# Altium project StrainGaugeAmpli.PrjPcb
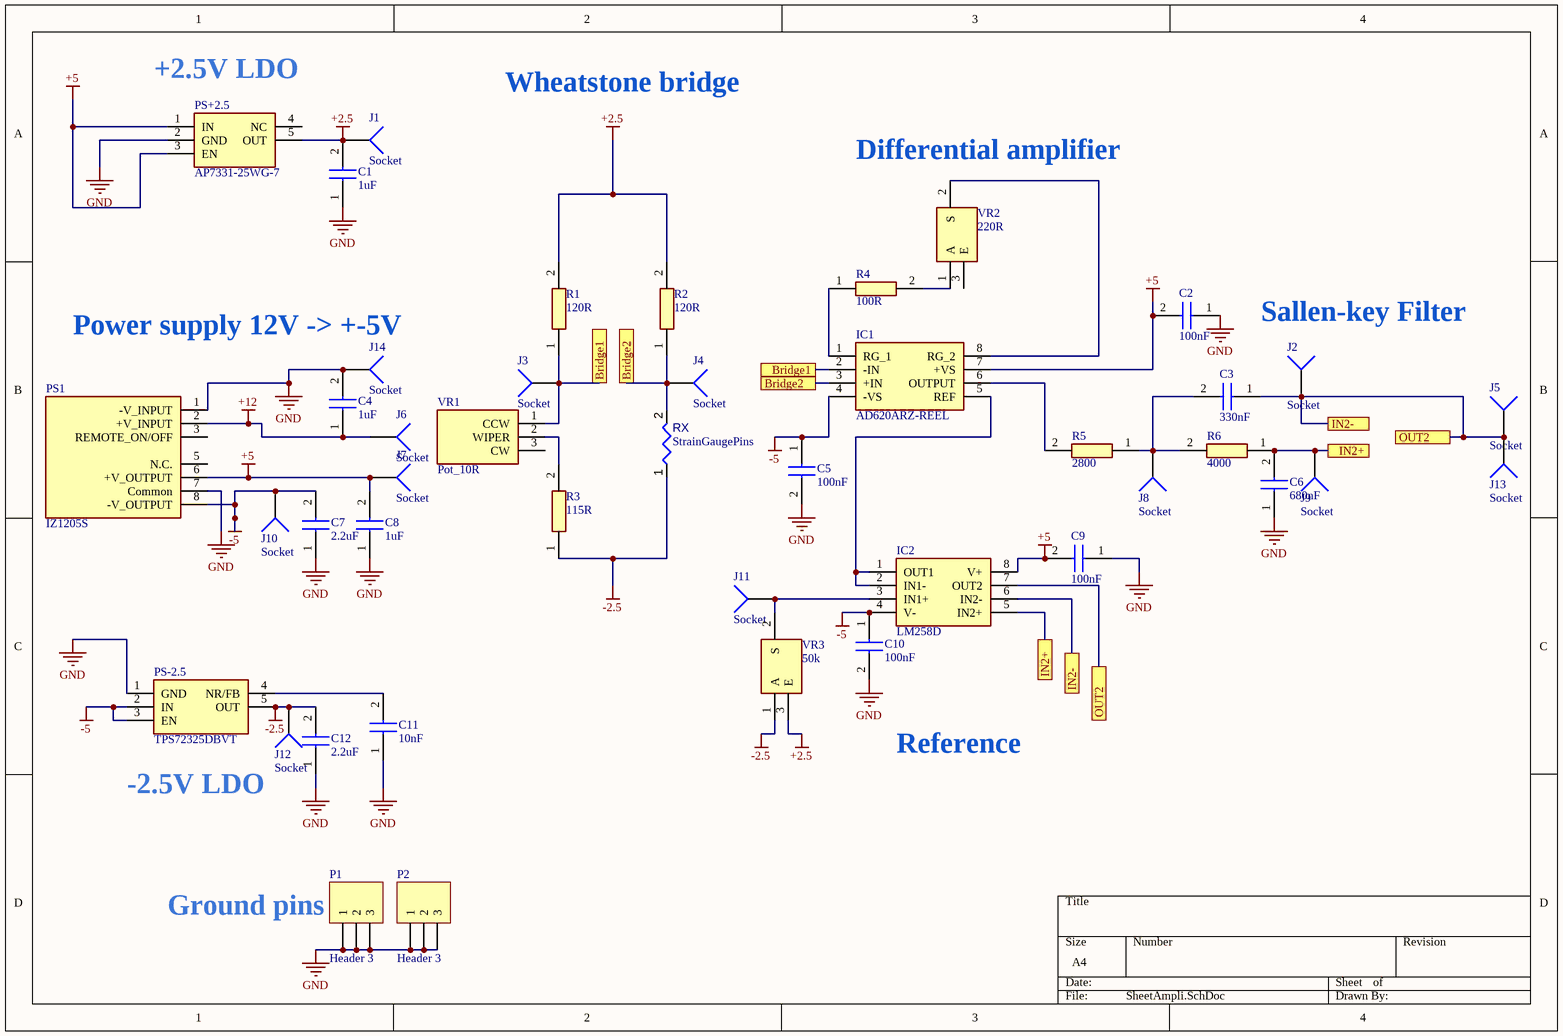
[diagram p0: SheetAmpli.SchDoc]
1 sheet, 43 parts. Net scope: flat (ports and power ports of the same name join across sheets).
Board file: PCBAmpli.PcbDoc

## Sheet SheetAmpli.SchDoc: Strain gauge amplification
size A4; Date: 27/05/2021; DrawnBy: M. Verstraeten; Revision: 1; SheetNumber: 1; SheetTotal: 1

### Parts
C1  1uF  [CAPC2012X94N]
C2  100nF  [CAPC2012X94N]
C3  330nF  [CAPC2012X94N]
C4  1uF  [CAPC2012X94N]
C5  100nF  [CAPC2012X94N]
C6  680nF  [CAPC2012X94N]
C7  2.2uF  [CAPC2012X94N]
C8  1uF  [CAPC2012X94N]
C9  100nF  [CAPC2012X94N]
C10  100nF  [CAPC2012X94N]
C11  10nF  [CAPC2012X94N]
C12  2.2uF  [CAPC2012X94N]
IC1  AD620ARZ-REEL  [SOIC127P600X175-8N]
IC2  LM258D  [SOIC127P600X175-8N]
J1  Socket  [PIN1]
J2  Socket  [PIN1]
J3  Socket  [PIN1]
J4  Socket  [PIN1]
J5  Socket  [PIN1]
J6  Socket  [PIN1]
J7  Socket  [PIN1]
J8  Socket  [PIN1]
J9  Socket  [PIN1]
J10  Socket  [PIN1]
J11  Socket  [PIN1]
J12  Socket  [PIN1]
J13  Socket  [PIN1]
J14  Socket  [PIN1]
P1  Header 3  [HDR1X3]
P2  Header 3  [HDR1X3]
PS1  IZ1205S  [IZ1205S]
PS+2.5  AP7331-25WG-7  [SOT95P285X130-5N]
PS-2.5  TPS72325DBVT  [SOT95P280X145-5N]
R1  120R  [RESC2012X65N]
R2  120R  [RESC2012X65N]
R3  115R  [RESC2012X65N]
R4  100R  [RESC2012X65N]
R5  2800  [RESC2012X65N]
R6  4000  [RESC2012X65N]
RX  value StrainGaugePins  [RESA60-630X240]
VR1  Pot_10R  [3296W-1]
VR2  220R  [PT10LV10473A2020PMS]
VR3  50k  [PT10LV10473A2020PMS]

### Ports
Bridge1, Bridge2, IN2+, IN2-, OUT2

### Nets
+2.5: C1.2 J1.1 PS+2.5.5(OUT) R1.2 R2.2 VR3.3(E)
+5: C2.2 C8.2 C9.2 IC1.7(+VS) IC2.8(V+) J7.1 PS1.6(+V_OUTPUT) PS+2.5.1(IN) PS+2.5.3(EN)
+12: C4.1 J6.1 PS1.2(+V_INPUT)
-2.5: C12.2 J12.1 PS-2.5.5(OUT) R3.1 RX.1 VR3.1(A)
-5: C5.1 C7.2 C10.1 IC1.4(-VS) IC2.4(V-) J10.1 PS1.8(-V_OUTPUT) PS-2.5.2(IN) PS-2.5.3(EN)
GND: C1.1 C2.1 C4.2 C5.2 C6.1 C7.1 C8.1 C9.1 C10.2 C11.1 C12.1 J14.1 P1.1 P1.2 P1.3 P2.1 P2.2 P2.3 PS1.1(-V_INPUT) PS1.7(Common) PS+2.5.2(GND) PS-2.5.1(GND)
NetC3_1: C3.1 IC2.6(IN2-) IC2.7(OUT2) J2.1 J5.1 J13.1 ; port IN2-, port OUT2
NetC3_2: C3.2 J8.1 R5.1 R6.2
NetC6_2: C6.2 IC2.5(IN2+) J9.1 R6.1 ; port IN2+
NetC11_2: C11.2 PS-2.5.4(NR/FB)
NetIC1_1: IC1.1(RG_1) R4.1
NetIC1_2: IC1.2(-IN) J3.1 R1.1 VR1.1(CCW) ; port Bridge1
NetIC1_3: IC1.3(+IN) J4.1 R2.1 RX.2 ; port Bridge2
NetIC1_5: IC1.5(REF) IC2.1(OUT1) IC2.2(IN1-)
NetIC1_6: IC1.6(OUTPUT) R5.2
NetIC1_8: IC1.8(RG_2) VR2.2(S)
NetIC2_3: IC2.3(IN1+) J11.1 VR3.2(S)
NetR3_2: R3.2 VR1.2(WIPER)
NetR4_2: R4.2 VR2.1(A)

Not connected (* = marked no-connect by the designer): PS1 3(REMOTE_ON/OFF) 5(N.C.); PS+2.5 4(NC); VR1 3(CW); VR2 3(E)

### Notes on the sheet
- (near PS+2.5) +2.5V LDO
- Wheatstone bridge
- (near VR2) Differential amplifier
- (near J14) Power supply 12V -> +-5V
- (near J2) Sallen-key Filter
- Reference
- -2.5V LDO
- (near P1) Ground pins

### Library data of the parts
C1-C12 = 08055A130JAT2A: Capacitor; Manufacturer_Name: AVX; Datasheet Link: https://componentsearchengine.com/Datasheets/1/06031A100FAT2A.pdf; Height: 0.94mm; Manufacturer_Part_Number: 08055A130JAT2A; Mouser Part Number: 581-08055A130JAT2A; Mouser Price/Stock: https://www.mouser.com/Search/Refine.aspx?Keyword=581-08055A130JAT2A
IC1 = AD620ARZ-REEL: Integrated Circuit; Manufacturer_Name: Analog Devices; Datasheet Link: http://www.analog.com/media/en/technical-documentation/data-sheets/AD620.pdf; Height: 1.75mm; Manufacturer_Part_Number: AD620ARZ-REEL; Mouser Part Number: 584-AD620ARZ-R; Mouser Price/Stock: https://www.mouser.co.uk/ProductDetail/Analog-Devices/AD620ARZ-REEL?qs=NmRFExCfTkHbJAB6iFkAaA%3D%3D; Arrow Part Number: AD620ARZ-REEL; Arrow Price/Stock: https://www.arrow.com/en/products/ad620arz-reel/analog-devices
IC2 = LM258D: Integrated Circuit; Manufacturer_Name: Texas Instruments; Datasheet Link: https://www.ti.com/lit/ds/symlink/lm358ba.pdf?ts=1593158783808&ref_url=https%253A%252F%252Fwww.ti.com%252Fsitesearch%252Fdocs%252Funiversalsearch.tsp%253FsearchTerm%253DLM258D; Height: 1.75mm; Manufacturer_Part_Number: LM258D; Mouser Part Number: 595-LM258D; Mouser Price/Stock: https://www.mouser.co.uk/ProductDetail/Texas-Instruments/LM258D?qs=afYny40WCj3%252BQVZnkBXQ5Q%3D%3D; Arrow Part Number: LM258D; Arrow Price/Stock: https://www.arrow.com/en/products/lm258d/texas-instruments
P1 P2 = Header 3: Header, 3-Pin; LatestRevisionDate: 17-Jul-2002; LatestRevisionNote: Re-released for DXP Platform.; Publisher: Altium Limited
PS1 = IZ1205S: Power Supply; Manufacturer_Name: XP POWER; Datasheet Link: https://www.xppower.com/portals/0/pdfs/SF_IZ.pdf; Height: 11.1mm; Manufacturer_Part_Number: IZ1205S; Mouser Part Number: 209-IZ1205S; Mouser Price/Stock: https://www.mouser.co.uk/ProductDetail/XP-Power/IZ1205S?qs=w%2Fv1CP2dgqrcXpexIyZ%252BMg%3D%3D
PS+2.5 = AP7331-33WG-7: Power Supply; Manufacturer_Name: Diodes Inc.; Datasheet Link: http://uk.rs-online.com/web/p/products/1219606; Height: 1.3mm; Manufacturer_Part_Number: AP7331-33WG-7; Mouser Part Number: 621-AP7331-33WG-7; Mouser Price/Stock: https://www.mouser.co.uk/ProductDetail/Diodes-Incorporated/AP7331-33WG-7?qs=vIZ3oKQCLxrSho%2FIWbe2%252BQ%3D%3D; Arrow Part Number: AP7331-33WG-7; Arrow Price/Stock: https://www.arrow.com/en/products/ap7331-33wg-7/diodes-incorporated
PS-2.5 = TPS72325DBVT: Integrated Circuit; Manufacturer_Name: Texas Instruments; Datasheet Link: http://www.ti.com/general/docs/lit/getliterature.tsp?genericPartNumber=TPS723&fileType=pdf; Height: 1.45mm; Manufacturer_Part_Number: TPS72325DBVT; Mouser Part Number: 595-TPS72325DBVT; Mouser Price/Stock: https://www.mouser.co.uk/ProductDetail/Texas-Instruments/TPS72325DBVT/?qs=6zVL%252ByCp0mqucRjl8KaDcw%3D%3D; Arrow Part Number: TPS72325DBVT; Arrow Price/Stock: https://www.arrow.com/en/products/tps72325dbvt/texas-instruments
R1-R6 = CRG0805F100K: Resistor; Manufacturer_Name: TE Connectivity; Datasheet Link: http://www.te.com/commerce/DocumentDelivery/DDEController?Action=showdoc&DocId=Customer+Drawing%7F1623109%7FBA%7Fpdf%7FEnglish%7FENG_CD_1623109_BA.pdf%7F1623109-1; Height: 0.65mm; Manufacturer_Part_Number: CRG0805F100K; Mouser Part Number: 279-CRG0805F100K; Mouser Price/Stock: https://www.mouser.co.uk/ProductDetail/TE-Connectivity-Neohm/CRG0805F100K?qs=VHcS2MTj4gaSH6styLNYqg%3D%3D; Arrow Part Number: CRG0805F100K; Arrow Price/Stock: https://www.arrow.com/en/products/crg0805f100k/te-connectivity
RX = CMP-009-00045-3: Axial Resistor, 100 KOhm, +/- 1%, 0.25 W, -55 to 155 degC, 2-Pin THD, RoHS, Bulk; Manufacturer: Yageo; Power: 250mW; Voltage Rating: 250V; Datasheet URL: http://www.yageo.com/documents/recent/Yageo%20LR_MFR_2013.pdf; Package Quantity: 200; Mounting Technology: TH; Manufacturer URL: http://www.yageo.com/; Package Description: 2-Pin Axial Lead, Dia 2.4 mm, Body Length 6.3 mm; Package Reference: MFR-25; Case/Package: Axial; Max Operating Temperature: 155°C; Datasheet Version: Apr-13; Tolerance: 1%; Packaging: Bulk; Min Operating Temperature: -55°C; RoHS Compliant: True
VR1 = 3296W-1-103LF: Variable Resistor; Manufacturer_Name: Bourns; Datasheet Link: https://www.bourns.com/pdfs/3296.pdf; Manufacturer_Part_Number: 3296W-1-103LF; Mouser Part Number: 652-3296W-1-103LF; Mouser Price/Stock: https://www.mouser.co.uk/ProductDetail/Bourns/3296W-1-103LF?qs=CL3xLxiry19Id6AEaxYcng%3D%3D; Arrow Part Number: 3296W-1-103LF; Arrow Price/Stock: https://www.arrow.com/en/products/3296w-1-103lf/bourns?region=europe
VR2 VR3 = PT10LV10-103A2020: Variable Resistor; Manufacturer_Name: PIHER; Datasheet Link: https://www.piher.net/pdf/12-PT10v03.pdf; Height: 5mm; Manufacturer_Part_Number: PT10LV10-103A2020; Mouser Part Number: 531-PT10V-10K; Mouser Price/Stock: https://www.mouser.co.uk/ProductDetail/Amphenol-Piher/PT10LV10-103A2020?qs=PZ1ub9NEDaWrX8IHli%2FVDQ%3D%3D; Arrow Part Number: PT10LV10-103A2020; Arrow Price/Stock: https://www.arrow.com/en/products/pt10lv10-103a2020/piher
J1-J14 = Socket: LatestRevisionDate: 17-Jul-2002; LatestRevisionNote: Re-released for DXP Platform.; Publisher: Altium Limited